# Altium schematic sheet NRF52.SchDoc
size A4; SheetNumber: 26; SheetTotal: 28
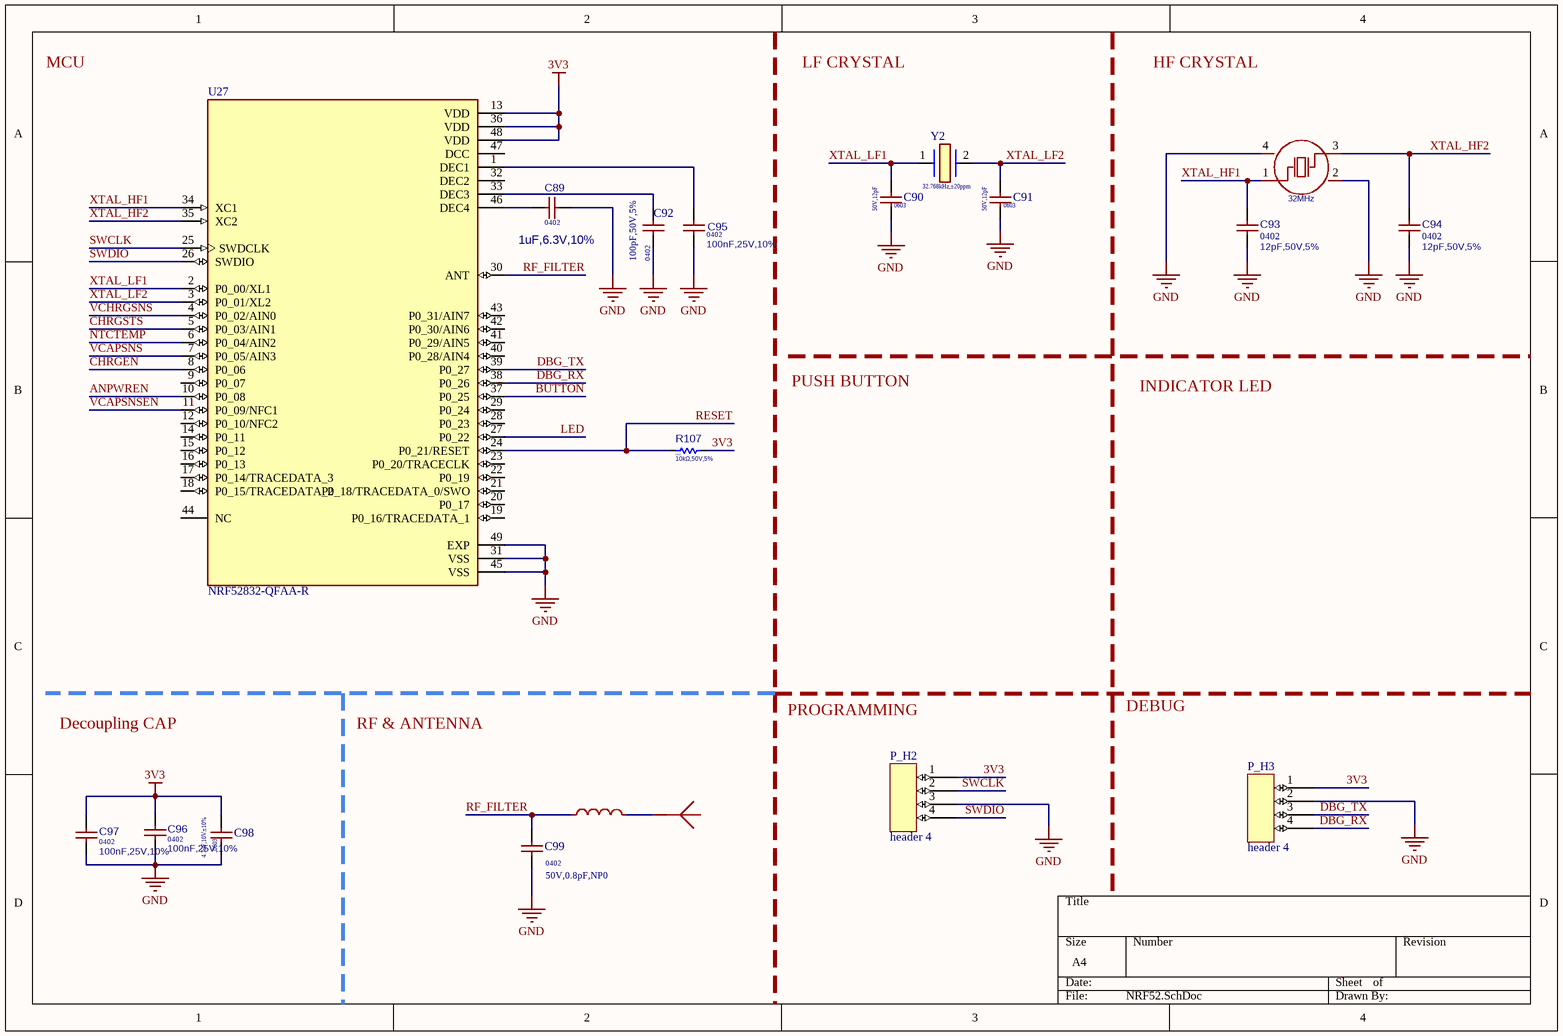
[diagram p0: NRF52.SchDoc]

## Parts
AE1  2450AT18A100E  [ANT 1206]  (value not drawn)
C89  value 1uF,6.3V,10%  Package: 0402  [C0402]  (hidden comment: 1uF)
C90  value 50V,12pF  Package: 0603  [CAPC1608X90N]  (hidden comment: 12pF)
C91  value 50V,12pF  Package: 0603  [CAPC1608X90N]  (hidden comment: 12pF)
C92  value 100pF,50V,5%  Package: 0402  [C0402]  (hidden comment: 100pF)
C93  Package: 0402  [C0402]  (hidden comment: 12pF,50V,5%)
C94  Package: 0402  [C0402]  (hidden comment: 12pF,50V,5%)
C95  value 100nF,25V,10%  Package: 0402  [C0402]  (hidden comment: 100nF)
C96  value 100nF,25V,10%  Package: 0402  [C0402]  (hidden comment: 100nF)
C97  value 100nF,25V,10%  Package: 0402  [C0402]  (hidden comment: 100nF)
C98  value 4.7uF,10V±10%  Package: 0603  [C0603]  (hidden comment: 4.7uf)
C99  value 50V,0.8pF,NP0  Package: 0402  [C0402]  (hidden comment: 0.8pF)
L4  3.9nH  [L-0402]  (value not drawn)
P_H2  header 4  [pin header 4]
P_H3  header 4  [pin header 4]
R107  value 10kΩ,50V,5%  Package: 0402  [R0402]  (hidden comment: 10kΩ)
U27  NRF52832-QFAA-R  [QFN40P600X600X90-49N]
X3  32MHz  [SMD2016-4P,crystral]
Y2  value 32.768kHz,±20ppm  [SMD3215-2P]  (hidden comment: 32.768kHz)

## Nets
3V3: C96.2 C97.2 C98.1 P_H2.1 P_H3.1 R107.2 U27.13(VDD) U27.36(VDD) U27.48(VDD)
GND: C89.2 C90.1 C91.1 C92.1 C93.1 C94.1 C95.1 C96.1 C97.1 C98.2 C99.1 P_H2.3 P_H3.2 U27.31(VSS) U27.45(VSS) U27.49(EXP) X3.2 X3.4
ANPWREN: U27.10(P0_08)
BUTTON: U27.37(P0_25)
CHRGEN: U27.8(P0_06)
CHRGSTS: U27.5(P0_03/AIN1)
DBG_RX: P_H3.4 U27.38(P0_26)
DBG_TX: P_H3.3 U27.39(P0_27)
LED: U27.27(P0_22)
NTCTEMP: U27.6(P0_04/AIN2)
RESET: R107.1 U27.24(P0_21/RESET)
RF_FILTER: C99.2 L4.1 U27.30(ANT)
SWCLK: P_H2.2 U27.25(SWDCLK)
SWDIO: P_H2.4 U27.26(SWDIO)
VCAPSNS: U27.7(P0_05/AIN3)
VCAPSNSEN: U27.11(P0_09/NFC1)
VCHRGSNS: U27.4(P0_02/AIN0)
XTAL_HF1: C93.2 U27.34(XC1) X3.1(OSC1)
XTAL_HF2: C94.2 U27.35(XC2) X3.3(OSC2)
XTAL_LF1: C90.2 U27.2(P0_00/XL1) Y2.1(CRYSTAL_2)
XTAL_LF2: C91.2 U27.3(P0_01/XL2) Y2.2
NetAE1_1: AE1.1(ANT) L4.2
NetC89_1: C89.1 U27.46(DEC4)
NetC92_2: C92.2 U27.33(DEC3)
NetC95_2: C95.2 U27.1(DEC1)

Not connected (* = marked no-connect by the designer): AE1 2; U27 9(P0_07) 12(P0_10/NFC2) 14(P0_11) 15(P0_12) 16(P0_13) 17(P0_14/TRACEDATA_3) 18(P0_15/TRACEDATA_2) 19(P0_16/TRACEDATA_1) 20(P0_17) 21(P0_18/TRACEDATA_0/SWO) 22(P0_19) 23(P0_20/TRACECLK) 28(P0_23) 29(P0_24) 32(DEC2) 40(P0_28/AIN4) 41(P0_29/AIN5) 42(P0_30/AIN6) 43(P0_31/AIN7) 44(NC) 47(DCC)

## Notes on the sheet
- MCU
- LF CRYSTAL
- HF CRYSTAL
- PUSH BUTTON
- INDICATOR LED
- PROGRAMMING
- DEBUG
- Decoupling CAP
- RF & ANTENNA

## Library data of the parts
AE1 = 2450AT18A100E: 0.5dBi 2.4G Antenna 2.4GHz 2W 1206 Antennas ROHS; Manufacturer: JOHANSON; LCSC: C89334; MPN: 2450AT18A100E; Package: 1206; Datasheet: https://atta.szlcsc.com/upload/public/pdf/source/20180301/C89334_15198946260391384223.pdf; Operating Temperature: -40℃~+125℃
C89 = CC0402KRX7R5BB105: 6.3V 1uF X7R ±10% 0402 Multilayer Ceramic Capacitors MLCC - SMD/SMT ROHS; Manufacturer: YAGEO; Type: *; Min Operating Temp: -55; Datasheet: https://www.lcsc.com/datasheet/lcsc_datasheet_2409272231_YAGEO-CC0402KRX7R5BB105_C115046.pdf; MPN: CC0402KRX7R5BB105; Max Operating Temp: +85; LCSC: C115046
C90 C91 = 0603CG120J500NT: 50V 12pF C0G ±5% 0603 Multilayer Ceramic Capacitors MLCC - SMD/SMT ROHS; Manufacturer: FH; Datasheet: https://datasheet.lcsc.com/lcsc/2304140030_FH--Guangdong-Fenghua-Advanced-Tech-0603CG120J500NT_C1642.pdf; LCSC: C1642; MPN: 0603CG120J500NT
C92 = CC0402JRNPO9BN101: 50V 100pF NP0 ±5% 0402 Multilayer Ceramic Capacitors MLCC - SMD/SMT ROHS; Manufacturer: YAGEO; Datasheet: https://www.lcsc.com/datasheet/lcsc_datasheet_2304140030_YAGEO-CC0402JRNPO9BN101_C106200.pdf; LCSC: C106200; MPN: CC0402JRNPO9BN101
C93 C94 = CL05C120JB51PNC: 12 pF ±5% 50V Ceramic Capacitor C0G, NP0 0402 (1005 Metric); Manufacturer: SAMSUNG; Min Operating Temp: -55; Datasheet: https://mm.digikey.com/Volume0/opasdata/d220001/medias/docus/41/CL05C120JB51PNC_Spec.pdf; MPN: CL05C120JB51PNC; Max Operating Temp: +125; LCSC: C472446; value: 12pF,50V,5%
C95-C97 = CL05A104KA5NNNC: 25V 100nF X5R ±10% 0402 Multilayer Ceramic Capacitors MLCC - SMD/SMT ROHS; Manufacturer: SAMSUNG; Type: *; MPN: CL05A104KA5NNNC; Max Operating Temp: +85; Min Operating Temp: -55; Datasheet: https://datasheet.lcsc.com/lcsc/2304140030_Samsung-Electro-Mechanics-CL05A104KA5NNNC_C100072.pdf; LCSC: C100072
C98 = 0603B475K100NT: 10V 4.7uF X7R ±10% 0603 Multilayer Ceramic Capacitors MLCC - SMD/SMT ROHS; MPN: CL10A475KQ8NNNC; Manufacturer: Samsung Electro-Mechanics; Datasheet: https://lcsc.componentsearchengine.com/Datasheets/2/CL10A475KQ8NNNC.pdf
C99 = RF15N0R8A500: 50V 0.8pF NP0 0402 Multilayer Ceramic Capacitors MLCC - SMD/SMT ROHS; Manufacturer: Walsin Tech Corp; LCSC: C172853; Datasheet: https://www.lcsc.com/datasheet/lcsc_datasheet_2304140030_Walsin-Tech-Corp-RF15N0R8A500_C172853.pdf; MPN: RF15N0R8A500
L4 = SDCL1005C3N9STDF: 300mA 3.9nH 200mΩ 0402 Inductors (SMD) ROHS; Manufacturer: Sunlord; LCSC: C14033; MPN: SDCL1005C3N9STDF; Package: 0402; Datasheet: https://atta.szlcsc.com/upload/public/pdf/source/20231027/6126A3AAC5912C34388756BE22DEE00C.pdf
P_H2 P_H3 = header 4: Straight 2.54mm 6mm -40℃~+105℃ 1 3mm 4 2.54mm Black Brass 1x4P Straight,P=2.54mm Pin Headers ROHS
R107 = RC0402JR-0710KL: 62.5mW Thick Film Resistors 50V ±100ppm/℃ ±5% 10kΩ 0402 Chip Resistor - Surface Mount ROHS; Manufacturer: YAGEO; MPN: RC0402JR-0710KL; Max Operating Temp: +155; Min Operating Temp: -55; Datasheet: https://datasheet.lcsc.com/lcsc/1810241334_YAGEO-RC0402JR-0710KL_C60489.pdf; LCSC: C60489
U27 = NRF52832-QFAA-R: IC RF TxRx + MCU Bluetooth, General ISM > 1GHz ANT, Bluetooth v5.0 2.4GHz 48-VFQFN Exposed Pad; Manufacturer: Nordic; LCSC: C77540; Package: VFQFN-48 Nordic Semiconductor; Value: *; MPN: NRF52832-QFAA-R; Datasheet: https://www.lcsc.com/datasheet/lcsc_datasheet_1810010217_Nordic-Semicon-NRF52832-QFAA-R_C77540.pdf; Operating Temperature: -40°C ~ 85°C
X3 = X2C032000B81H-HS: 32MHz,SMD2016-4P Crystals ROHS; Manufacturer: HELE; LCSC: C254298; MPN: X2C032000B81H-HS; Package: SMD2016-4P; Datasheet: https://atta.szlcsc.com/upload/public/pdf/source/20190430/C254298_7A65B7D2FB33A890B7E374D25EF99C0B.pdf
Y2 = Q13FC1350000400: 32.768kHz SMD Crystal Resonator 12.5pF 70kΩ ±20ppm -40℃~+85℃ SMD3215-2P Crystals ROHS; Manufacturer: Seiko Epson; MPN: Q13FC1350000400; Datasheet: https://datasheet.lcsc.com/lcsc/1810171817_Seiko-Epson-Q13FC13500004_C32346.pdf; Package: SMD3215-2P; LCSC: C32346